# Altium schematic sheet ESC.SchDoc
size A4
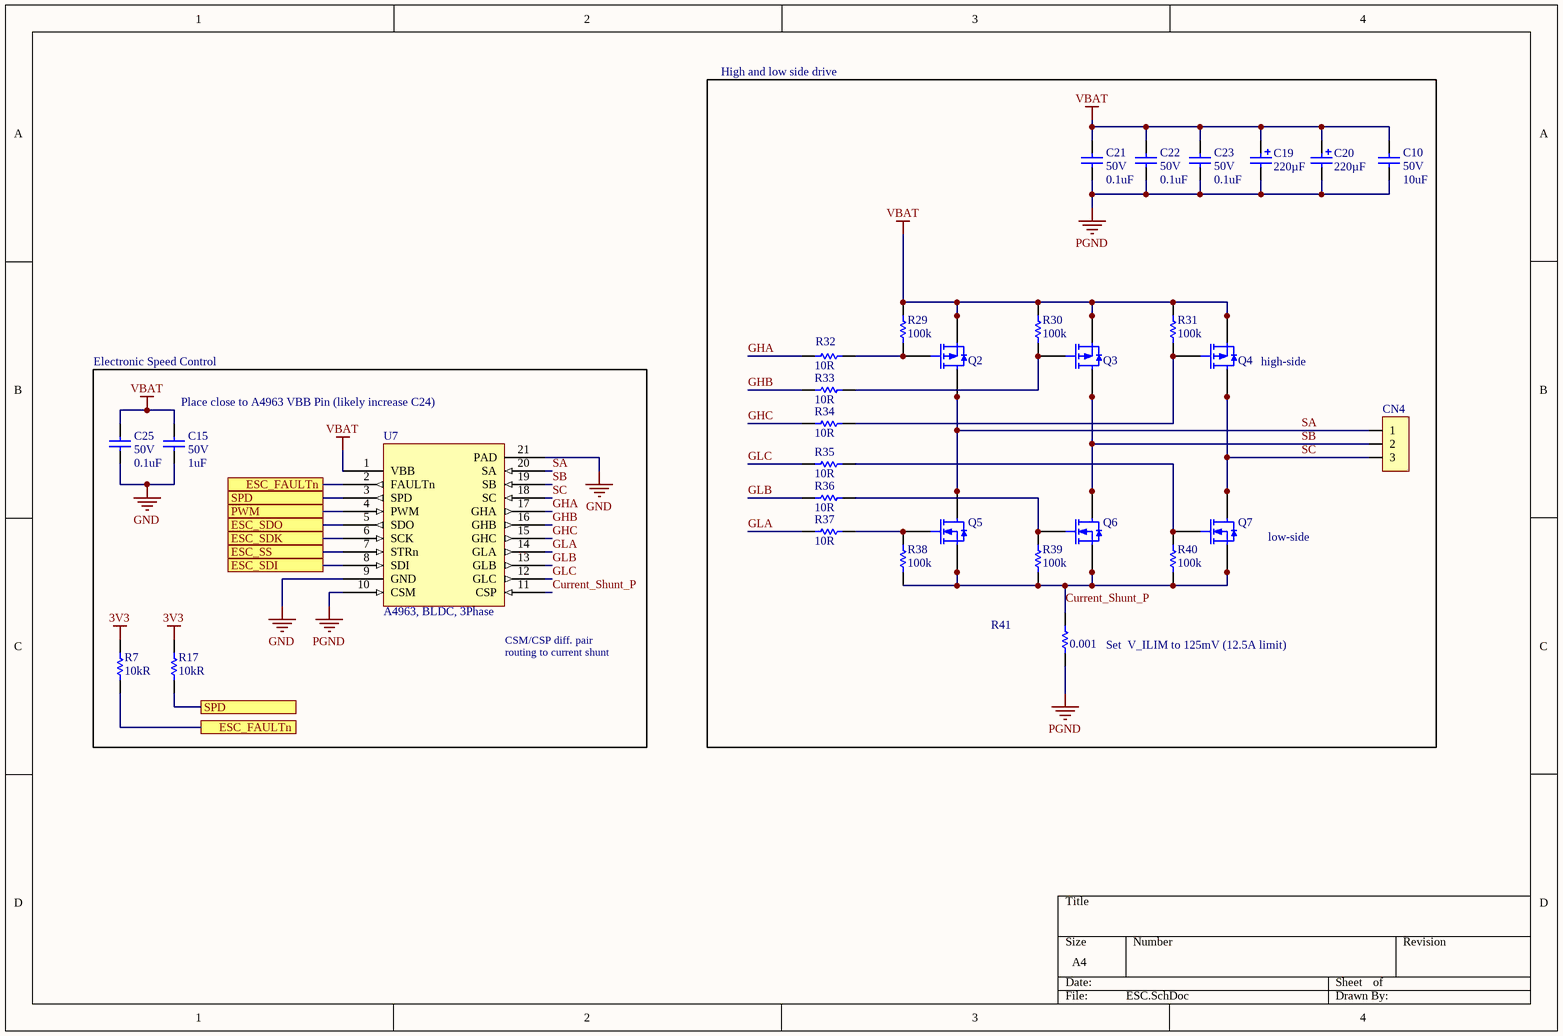
[diagram p0: ESC.SchDoc]

## Parts
C10  Voltage Rating (DC): 50V  Capacitance: 10uF  [CAPC3216X180X50ML20T30]  (hidden comment: CL31B106KBHNNNE)
C15  Capacitance: 1uF  Voltage: 50V  [0803 CAP]  (hidden comment: CL21B105KBFNNNG)
C19  value 220µF  [Radial_CAN_8.3mm_10.5mm]  (hidden comment: 220uF, 50V, 20%, Alum, Polarized, SMD)
C20  value 220µF  [Radial_CAN_8.3mm_10.5mm]  (hidden comment: 220uF, 50V, 20%, Alum, Polarized, SMD)
C21  Voltage: 50V  Capacitance: 0.1uF  [FP-CL10-0_1-MFG]  (hidden comment: CL10B104JB8NNNC)
C22  Voltage: 50V  Capacitance: 0.1uF  [FP-CL10-0_1-MFG]  (hidden comment: CL10B104JB8NNNC)
C23  Voltage: 50V  Capacitance: 0.1uF  [FP-CL10-0_1-MFG]  (hidden comment: CL10B104JB8NNNC)
C25  Voltage: 50V  Capacitance: 0.1uF  [FP-CL10-0_1-MFG]  (hidden comment: CL10B104JB8NNNC)
CN4  3x1, Terminal Block, Pitch: 5mm, Screw, THT  [3x1, Terminal Block, Pitch: 5mm, Screw, THT]  (value not drawn)
Q2  SI7625DN-T1-GE3  [PowerPAK 1212-8]  (value not drawn)
Q3  SI7625DN-T1-GE3  [PowerPAK 1212-8]  (value not drawn)
Q4  SI7625DN-T1-GE3  [PowerPAK 1212-8]  (value not drawn)
Q5  SIS476DN-T1-GE3  [PowerPAK 1212-8]  (value not drawn)
Q6  SIS476DN-T1-GE3  [PowerPAK 1212-8]  (value not drawn)
Q7  SIS476DN-T1-GE3  [PowerPAK 1212-8]  (value not drawn)
R7  Resistance: 10kR  [RESC1608X55X25ML10T15]  (hidden comment: RC0603FR-0710KL)
R17  Resistance: 10kR  [RESC1608X55X25ML10T15]  (hidden comment: RC0603FR-0710KL)
R29  value 100k  [RESC1608N(0603")]  (hidden comment: 100kR, 1%, 1/10W, 0603 SMD)
R30  value 100k  [RESC1608N(0603")]  (hidden comment: 100kR, 1%, 1/10W, 0603 SMD)
R31  value 100k  [RESC1608N(0603")]  (hidden comment: 100kR, 1%, 1/10W, 0603 SMD)
R32  Resistance: 10R  [FP-ERJ3EK-IPC_A]  (hidden comment: ERJ3EKF10R0V)
R33  Resistance: 10R  [FP-ERJ3EK-IPC_A]  (hidden comment: ERJ3EKF10R0V)
R34  Resistance: 10R  [FP-ERJ3EK-IPC_A]  (hidden comment: ERJ3EKF10R0V)
R35  Resistance: 10R  [FP-ERJ3EK-IPC_A]  (hidden comment: ERJ3EKF10R0V)
R36  Resistance: 10R  [FP-ERJ3EK-IPC_A]  (hidden comment: ERJ3EKF10R0V)
R37  Resistance: 10R  [FP-ERJ3EK-IPC_A]  (hidden comment: ERJ3EKF10R0V)
R38  value 100k  [RESC1608N(0603")]  (hidden comment: 100kR, 1%, 1/10W, 0603 SMD)
R39  value 100k  [RESC1608N(0603")]  (hidden comment: 100kR, 1%, 1/10W, 0603 SMD)
R40  value 100k  [RESC1608N(0603")]  (hidden comment: 100kR, 1%, 1/10W, 0603 SMD)
R41  value 0.001  [RESC6332N(2512")]  (hidden comment: CSRL3-0R001F8)
U7  A4963, BLDC, 3Phase  [TSOP65P640X120_HS-21M]

## Ports
ESC_FAULTn, ESC_SDI, ESC_SDK, ESC_SDO, ESC_SS, PWM, SPD

## Nets
3V3: R7.1 R17.1
GND: C15.1 C25.1 U7.9(GND) U7.21(PAD)
PGND: C10.1 C19.2(Cathode) C20.2(Cathode) C21.1 C22.1 C23.1 R41.1 U7.10(CSM)
VBAT: C10.2 C15.2 C19.1(Anode) C20.1(Anode) C21.2 C22.2 C23.2 C25.2 Q2.1(Source) Q2.2(Source) Q2.3(Source) Q3.1(Source) Q3.2(Source) Q3.3(Source) Q4.1(Source) Q4.2(Source) Q4.3(Source) R29.2 R30.2 R31.2 U7.1(VBB)
Current_Shunt_P: Q5.1(Source) Q5.2(Source) Q5.3(Source) Q6.1(Source) Q6.2(Source) Q6.3(Source) Q7.1(Source) Q7.2(Source) Q7.3(Source) R38.1 R39.1 R40.1 R41.2 U7.11(CSP)
ESC_FAULTn: R7.2 U7.2(FAULTn) ; port ESC_FAULTn
ESC_SDI: U7.8(SDI) ; port ESC_SDI
ESC_SDK: U7.6(SCK) ; port ESC_SDK
ESC_SDO: U7.5(SDO) ; port ESC_SDO
ESC_SS: U7.7(STRn) ; port ESC_SS
GHA: R32.1 U7.17(GHA)
GHB: R33.1 U7.16(GHB)
GHC: R34.1 U7.15(GHC)
GLA: R37.1 U7.14(GLA)
GLB: R36.1 U7.13(GLB)
GLC: R35.1 U7.12(GLC)
PWM: U7.4(PWM) ; port PWM
SA: CN4.1 Q2.5(Drain) Q2.6(Drain) Q2.7(Drain) Q2.8(Drain) Q2.9(Drain) Q5.5(Drain) Q5.6(Drain) Q5.7(Drain) Q5.8(Drain) Q5.9(Drain) U7.20(SA)
SB: CN4.2 Q3.5(Drain) Q3.6(Drain) Q3.7(Drain) Q3.8(Drain) Q3.9(Drain) Q6.5(Drain) Q6.6(Drain) Q6.7(Drain) Q6.8(Drain) Q6.9(Drain) U7.19(SB)
SC: CN4.3 Q4.5(Drain) Q4.6(Drain) Q4.7(Drain) Q4.8(Drain) Q4.9(Drain) Q7.5(Drain) Q7.6(Drain) Q7.7(Drain) Q7.8(Drain) Q7.9(Drain) U7.18(SC)
SPD: R17.2 U7.3(SPD) ; port SPD
NetQ2_4: Q2.4(Gate) R29.1 R32.2
NetQ3_4: Q3.4(Gate) R30.1 R33.2
NetQ4_4: Q4.4(Gate) R31.1 R34.2
NetQ5_4: Q5.4(Gate) R37.2 R38.2
NetQ6_4: Q6.4(Gate) R36.2 R39.2
NetQ7_4: Q7.4(Gate) R35.2 R40.2

## Notes on the sheet
- High and low side drive
- Electronic Speed Control
- (near Q4) high-side
- (near C15) Place close to A4963 VBB Pin (likely increase C24)
- (near Q7) low-side
- (near U7) CSM/CSP diff. pair routing to current shunt
- (near R41) Set  V_ILIM to 125mV (12.5A limit)

## Library data of the parts
C10 = CMP-00004-2: Cap Ceramic 10uF 50V X7R 10% Pad SMD 1206 125°C T/R; Voltage Rating: 50V; Case/Package: 1206; Max Operating Temperature: 125°C; Min Operating Temperature: -55°C; Width: 0.063inch; Packaging: Tape and Reel; Lead Free: Lead Free; Mount: Surface Mount; Case Code (Imperial): 1206; Thickness: 0.071inch; Length: 0.126inch; Dielectric: X7R; Case Code (Metric): 3216; Tolerance: 10%
C15 = CMP-00005-3: SAMSUNG ELECTRO-MECHANICS - CL21B105KBFNNNG - MLCC CAPACITORS; Dielectric: X7R; Tolerance: 10%; Material: Ceramic; Min Operating Temperature: -55°C; Length: 2mm; Termination: Wraparound; Contact Plating: Tin; Package Quantity: 3000; Mount: Surface Mount; Max Operating Temperature: 125°C; Case Code (Imperial): 0805; Thickness: 0.053inch; Case/Package: 0805; Width: 0.049inch; Voltage Rating: 50V; Depth: 1.25mm; Packaging: Tape and Reel; Case Code (Metric): 2012
C19 C20 = CMP-006-0034-1: Capacitor, Polarized, Aluminum, 50V; Pin Count: 2; Component Type: Standard; Publisher: AUVic; Source: AUVic_Schematic_Library_Capacitors.SchLib; Design Item ID: 220uF, 50V, 20%, Alum, Polarized, SMD; Date Created: 2016-06-25; Created By: Ashwin Sira; PackageDescription: Can
C21-C23 C25 = CMP-00000-3: CAP CER 0.1UF 50V X7R 0603; Tolerance: 5%; Material: Ceramic; Case Code (Imperial): 0603; Mount: Surface Mount; Thickness: 0.035inch; Depth: 0.8mm; Packaging: Tape and Reel; Package Quantity: 1; Dielectric: X7R; Height: 0.8mm; Radiation Hardening: No; Max Operating Temperature: 125°C; Voltage Rating: 50V; Case/Package: 0603; Min Operating Temperature: -55°C; Case Code (Metric): 1608; Length: 1.6mm; Contact Plating: Tin; Width: 0.031inch
CN4 = CMP-005-0011-1: Source: AUVic_Schematic_Library_Connectors.SchLib; Last Updated: *; Publisher: AUVic, Ashwin Sira; Date Published: 2014-06-03; Component Type: Standard; Reviewed By: *; Design Item ID: 3x1, Terminal Block, Pitch: 5mm, Screw, THT; Pin Count: 3
Q2-Q4 = CMP-052-0024-1: P-Channel 30V 35A (Tc) 3.7W (Ta), 52W (Tc) Surface Mount PowerPAK® 1212-8; Source: AUVic_Schematic_Library_Transistors.SchLib; Component Type: Standard; Created By: Poorna Chander Kalidas; Design Item ID: SI7625DN-T1-GE3; Pin Count: 9
Q5-Q7 = CMP-052-0025-1: N-Channel 30V 40A (Tc) 3.7W (Ta), 52W (Tc) Surface Mount PowerPAK® 1212-8; Design Item ID: SIS476DN-T1-GE3; ComponentLink1URL: https://www.digikey.ca/product-detail/en/diodes-incorporated/DMN3023L-7/DMN3023L-7DICT-ND/5453155; Source: AUVic_Schematic_Library_Transistors.SchLib; ComponentLink1Description: Digi-Key; Pin Count: 9; Created By: Poorna Chander Kalidas; Component Type: Standard
R7 R17 = CMP-00037-2: Res General Purpose Thick Film 0603 10K Ohm 1% 1/10W ±100ppm/°C Molded SMD Paper T/R; Voltage Rating (DC): 50V; Power Rating: 100mW; Voltage Rating: 75V; REACH SVHC: No SVHC; Temperature Coefficient: 100ppm/°C; Military Standard: Not; Case Code (Metric): 1608; Case/Package: 0603; Number of Pins: 2; Lead Pitch: 0.3mm; Case Code (Imperial): 0603; Depth: 0.8mm; Lead Free: Lead Free; Composition: Thick Film; Termination: SMD/SMT; Height: 0.45mm; Packaging: Tape and Reel; Length: 1.6mm; Tolerance: 1%; Min Operating Temperature: -55°C; Width: 0.8mm; Max Operating Temperature: 155°C; Weight: 7.1E-05oz
R29-R31 R38-R40 = CMP-047-0010-1: Made By: Andy Bates; Owned By: AUVic; Component Type: Standard; Pin Count: 2; Design Item ID: 100kR, 1%, 1/10W, 0603 SMD; Source: AUVic_Schematic_Library_Resistors.SchLib; Last Edited: 14-06-30; Created On: 14-06-30
R32-R37 = CMP-00034-2: PANASONIC - ERJ3EKF10R0V - SMD Chip Resistor, 0603 [1608 Metric], 10 ohm, ERJ3EK Series, 75 V, Thick Film, 100 mW; Temperature Coefficient: 100ppm/°C; Tolerance: 1%; Max Power Dissipation: 100mW; Voltage Rating (DC): 75V; Package Quantity: 5000; Case Code (Imperial): 0603; Military Standard: Not; Depth: 0.8mm; Number of Terminations: 2; Working Voltage: 75V; Min Operating Temperature: -55°C; Width: 0.8mm; Composition: Thick Film; Packaging: Tape and Reel; Power Rating: 100mW; REACH SVHC: No SVHC; Max Operating Temperature: 155°C; Case Code (Metric): 1608; Features: Automotive AEC-Q200; Case/Package: 0603; Length: 1.6mm; Number of Pins: 2; Lead Free: Lead Free; Height: 0.45mm; Voltage Rating: 75V; Contact Plating: Tin; Termination: SMD/SMT; Mount: Surface Mount; Radiation Hardening: No
R41 = CMP-009-00000-2: Res 0.001 Ohm 1% 3W 2512
U7 = CMP-041-0002-1: A4963, BLDC, 3 Phase, Sensorless; Pin Count: 21; Component Type: Standard; Source: AUVic_Schematic_Library_Motor_Controllers.SchLib; Created By: Poorna Chander Kalidas; Design Item ID: A4963, BLDC, 3Phase